# Altium schematic sheet SonarControl.SchDoc
size A4
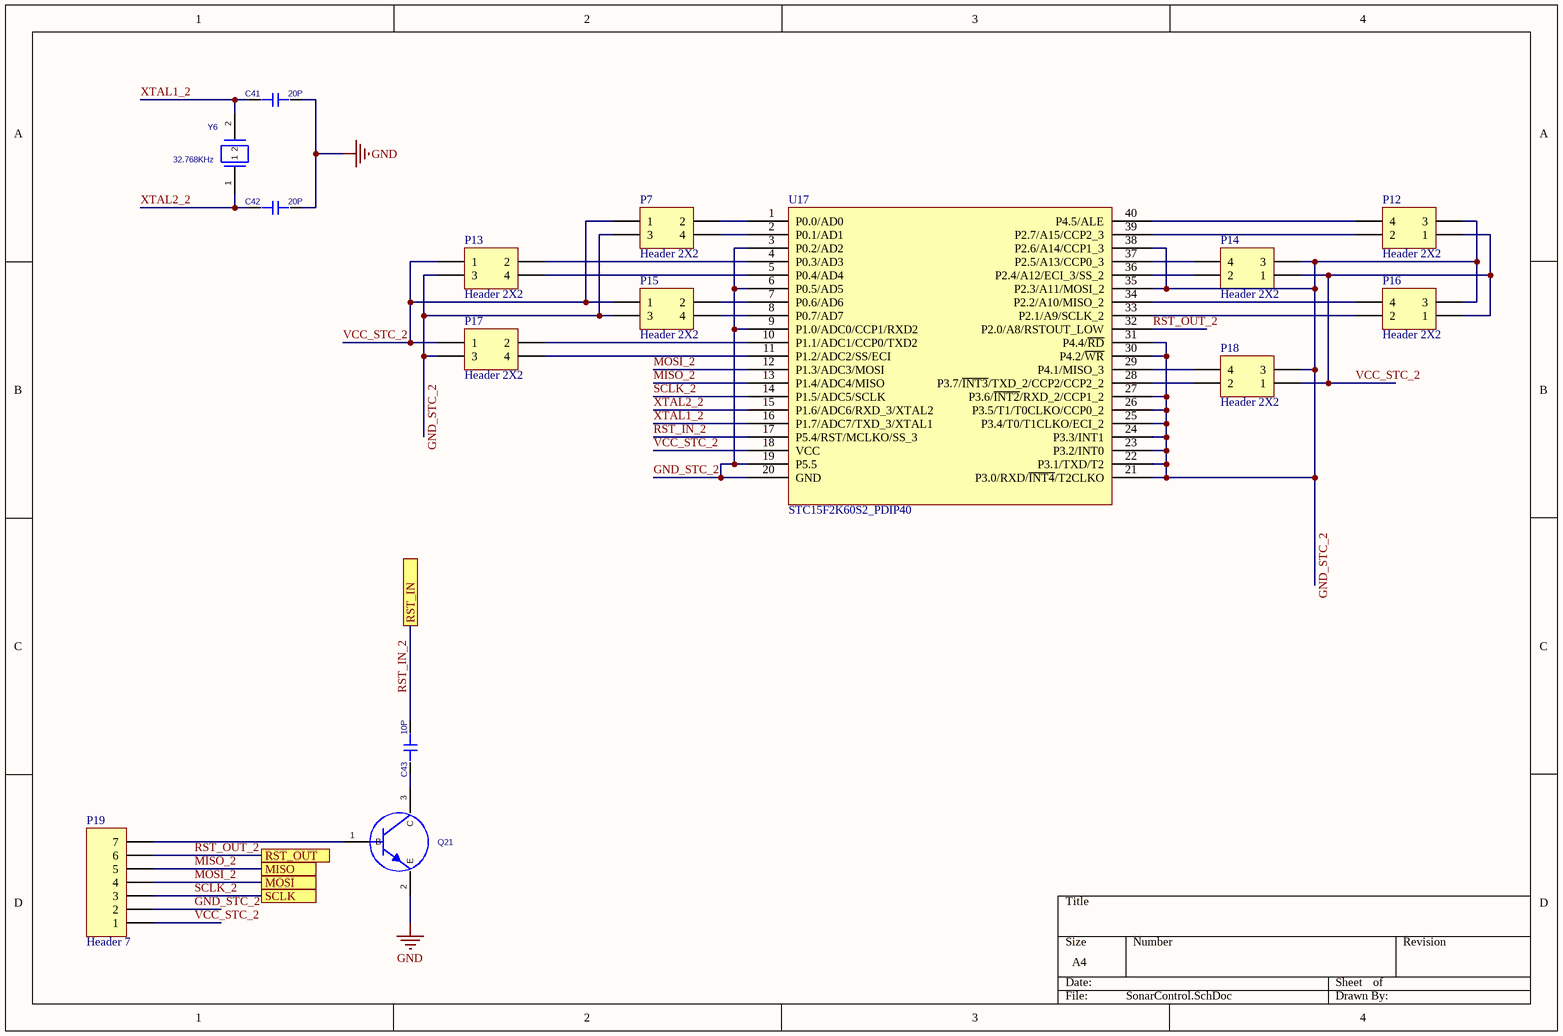
[diagram p0: SonarControl.SchDoc]

## Parts
C41  value 20P  [CAP_0603_FIRE]  (hidden comment: CAP_20P_0603_FIRE)
C42  value 20P  [CAP_0603_FIRE]  (hidden comment: CAP_20P_0603_FIRE)
C43  value 10P  [RES_0603_FIRE]  (hidden comment: CAP_10P_0603_FIRE)
P7  Header 2X2  [HDR2X2]
P12  Header 2X2  [HDR2X2]
P13  Header 2X2  [HDR2X2]
P14  Header 2X2  [HDR2X2]
P15  Header 2X2  [HDR2X2]
P16  Header 2X2  [HDR2X2]
P17  Header 2X2  [HDR2X2]
P18  Header 2X2  [HDR2X2]
P19  Header 7
Q21  8050  [SOT-23]  (value not drawn)
U17  STC15F2K60S2_PDIP40  [DIP40]
Y6  value 32.768KHz  [3215]  (hidden comment: XTAL_32.768KHZ_3215)

## Ports
MISO, MOSI, RST_IN, RST_OUT, SCLK

## Nets
GND: C41.2 C42.2 Q21.2(E)
GND_STC_2: P7.3 P12.3 P13.3 P14.3 P15.3 P16.3 P17.3 P18.3 P19.2 U17.3(P0.2/AD2) U17.6(P0.5/AD5) U17.9(P1.0/ADC0/CCP1/RXD2) U17.19(P5.5) U17.20(GND) U17.21(P3.0/RXD/~{INT4}/T2CLKO) U17.22(P3.1/TXD/T2) U17.23(P3.2/INT0) U17.24(P3.3/INT1) U17.25(P3.4/T0/T1CLKO/ECI_2) U17.26(P3.5/T1/T0CLKO/CCP0_2) U17.27(P3.6/~{INT2}/RXD_2/CCP1_2) U17.30(P4.2/~{WR}) U17.31(P4.4/~{RD}) U17.35(P2.3/A11/MOSI_2) U17.38(P2.6/A14/CCP1_3)
MISO_2: P19.5 U17.13(P1.4/ADC4/MISO) ; port MISO
MOSI_2: P19.4 U17.12(P1.3/ADC3/MOSI) ; port MOSI
RST_IN_2: C43.2 U17.17(P5.4/RST/MCLKO/SS_3) ; port RST_IN
RST_OUT_2: P19.6 U17.32(P2.0/A8/RSTOUT_LOW) ; port RST_OUT
SCLK_2: P19.3 U17.14(P1.5/ADC5/SCLK) ; port SCLK
VCC_STC_2: P7.1 P12.1 P13.1 P14.1 P15.1 P16.1 P17.1 P18.1 P19.1 U17.18(VCC)
XTAL1_2: C41.1 U17.16(P1.7/ADC7/TXD_3/XTAL1) Y6.2
XTAL2_2: C42.1 U17.15(P1.6/ADC6/RXD_3/XTAL2) Y6.1
NetC43_1: C43.1 Q21.3(C)
NetP7_2: P7.2 U17.1(P0.0/AD0)
NetP7_4: P7.4 U17.2(P0.1/AD1)
NetP12_2: P12.2 U17.39(P2.7/A15/CCP2_3)
NetP12_4: P12.4 U17.40(P4.5/ALE)
NetP13_2: P13.2 U17.4(P0.3/AD3)
NetP13_4: P13.4 U17.5(P0.4/AD4)
NetP14_2: P14.2 U17.36(P2.4/A12/ECI_3/SS_2)
NetP14_4: P14.4 U17.37(P2.5/A13/CCP0_3)
NetP15_2: P15.2 U17.7(P0.6/AD6)
NetP15_4: P15.4 U17.8(P0.7/AD7)
NetP16_2: P16.2 U17.33(P2.1/A9/SCLK_2)
NetP16_4: P16.4 U17.34(P2.2/A10/MISO_2)
NetP17_2: P17.2 U17.10(P1.1/ADC1/CCP0/TXD2)
NetP17_4: P17.4 U17.11(P1.2/ADC2/SS/ECI)
NetP18_2: P18.2 U17.28(P3.7/~{INT3}/TXD_2/CCP2/CCP2_2)
NetP18_4: P18.4 U17.29(P4.1/MISO_3)
NetP19_7: P19.7 Q21.1(B)

## Library data of the parts
C43 = CAP_10P_0603_FIRE: 0603; Manufacture 1: SUPERCAP; Tolerance: +-5%; PCB DECAL: RES_0603_FIRE
P7 P12-P18 = Header 2X2: Header, 2-Pin, Dual row; LatestRevisionDate: 17-Jul-2002; LatestRevisionNote: Re-released for DXP Platform.; Publisher: Altium Limited
P19 = Header 7: Header, 7-Pin; LatestRevisionDate: 17-Jul-2002; LatestRevisionNote: Re-released for DXP Platform.; Publisher: Altium Limited
Q21 = 8050: NPN; Manufacturer #2: 8050; PCB DECAL: SOT-23
Y6 = XTAL_32.768KHZ_3215: CRYSTAL; PCB DECAL: 3215
C41 C42 = CAP_20P_0603_FIRE: PCB DECAL: CAP_0603_FIRE